# Altium schematic sheet block diagram.SchDoc
size A3; DocumentNumber: 3; Revision: V1.0; SheetNumber: 3; SheetTotal: 11; Stage: DRAFT
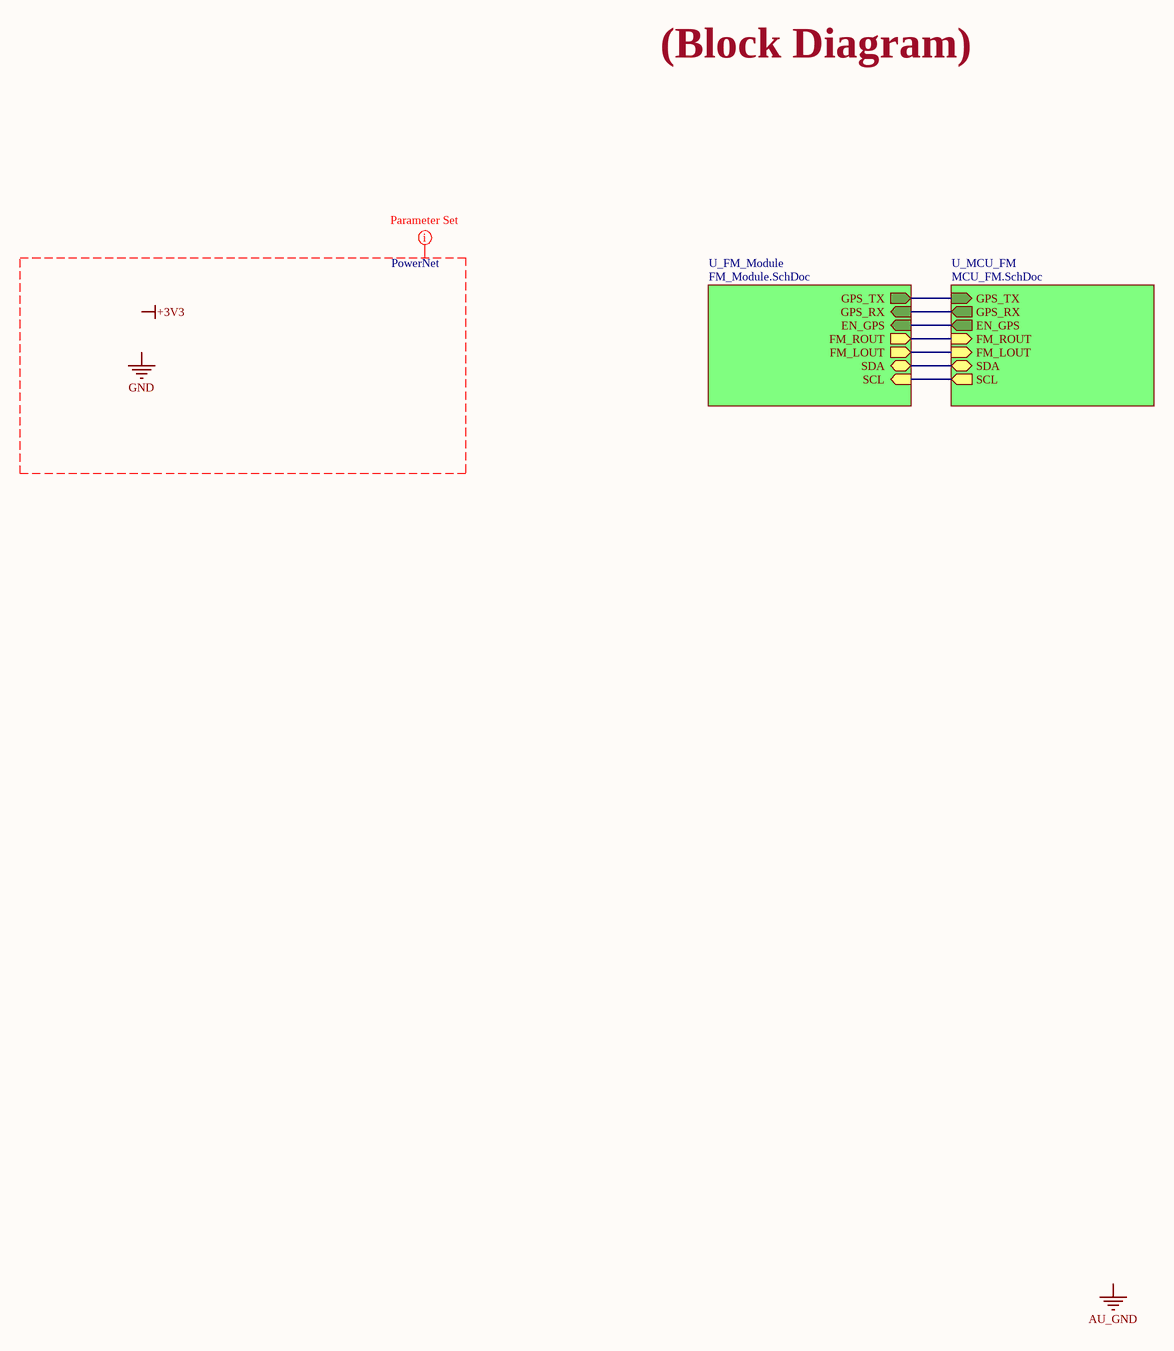
[diagram p0: block diagram.SchDoc]

## Sub-sheets
U_FM_Module = FM_Module.SchDoc: SCL (in), SDA (bidir), FM_LOUT (out), FM_ROUT (out), GPS_TX (out), GPS_RX (in), EN_GPS (in)
U_MCU_FM = MCU_FM.SchDoc: FM_LOUT (in), FM_ROUT (in), GPS_RX (out), SCL (out), SDA (bidir), GPS_TX (in), EN_GPS (out)

## Nets
(unnamed): sheet U_FM_Module/SCL, sheet U_MCU_FM/SCL
(unnamed): sheet U_FM_Module/SDA, sheet U_MCU_FM/SDA
(unnamed): sheet U_FM_Module/FM_LOUT, sheet U_MCU_FM/FM_LOUT
(unnamed): sheet U_FM_Module/FM_ROUT, sheet U_MCU_FM/FM_ROUT
(unnamed): sheet U_FM_Module/GPS_TX, sheet U_MCU_FM/GPS_TX
(unnamed): sheet U_FM_Module/GPS_RX, sheet U_MCU_FM/GPS_RX
(unnamed): sheet U_FM_Module/EN_GPS, sheet U_MCU_FM/EN_GPS

## Layout directives
net class PowerNet: +3V3, GND

## Notes on the sheet
- (Block Diagram)
- CLOCKS (CPU & PCIE)
- Labels drawn without touching a wire or pin: +3V3, AU_GND, GND
- Project:
- File:
- Size
- Rev
- A3
- Sheet
- /
- Drawn by:
- Checked by:
- Approved by: